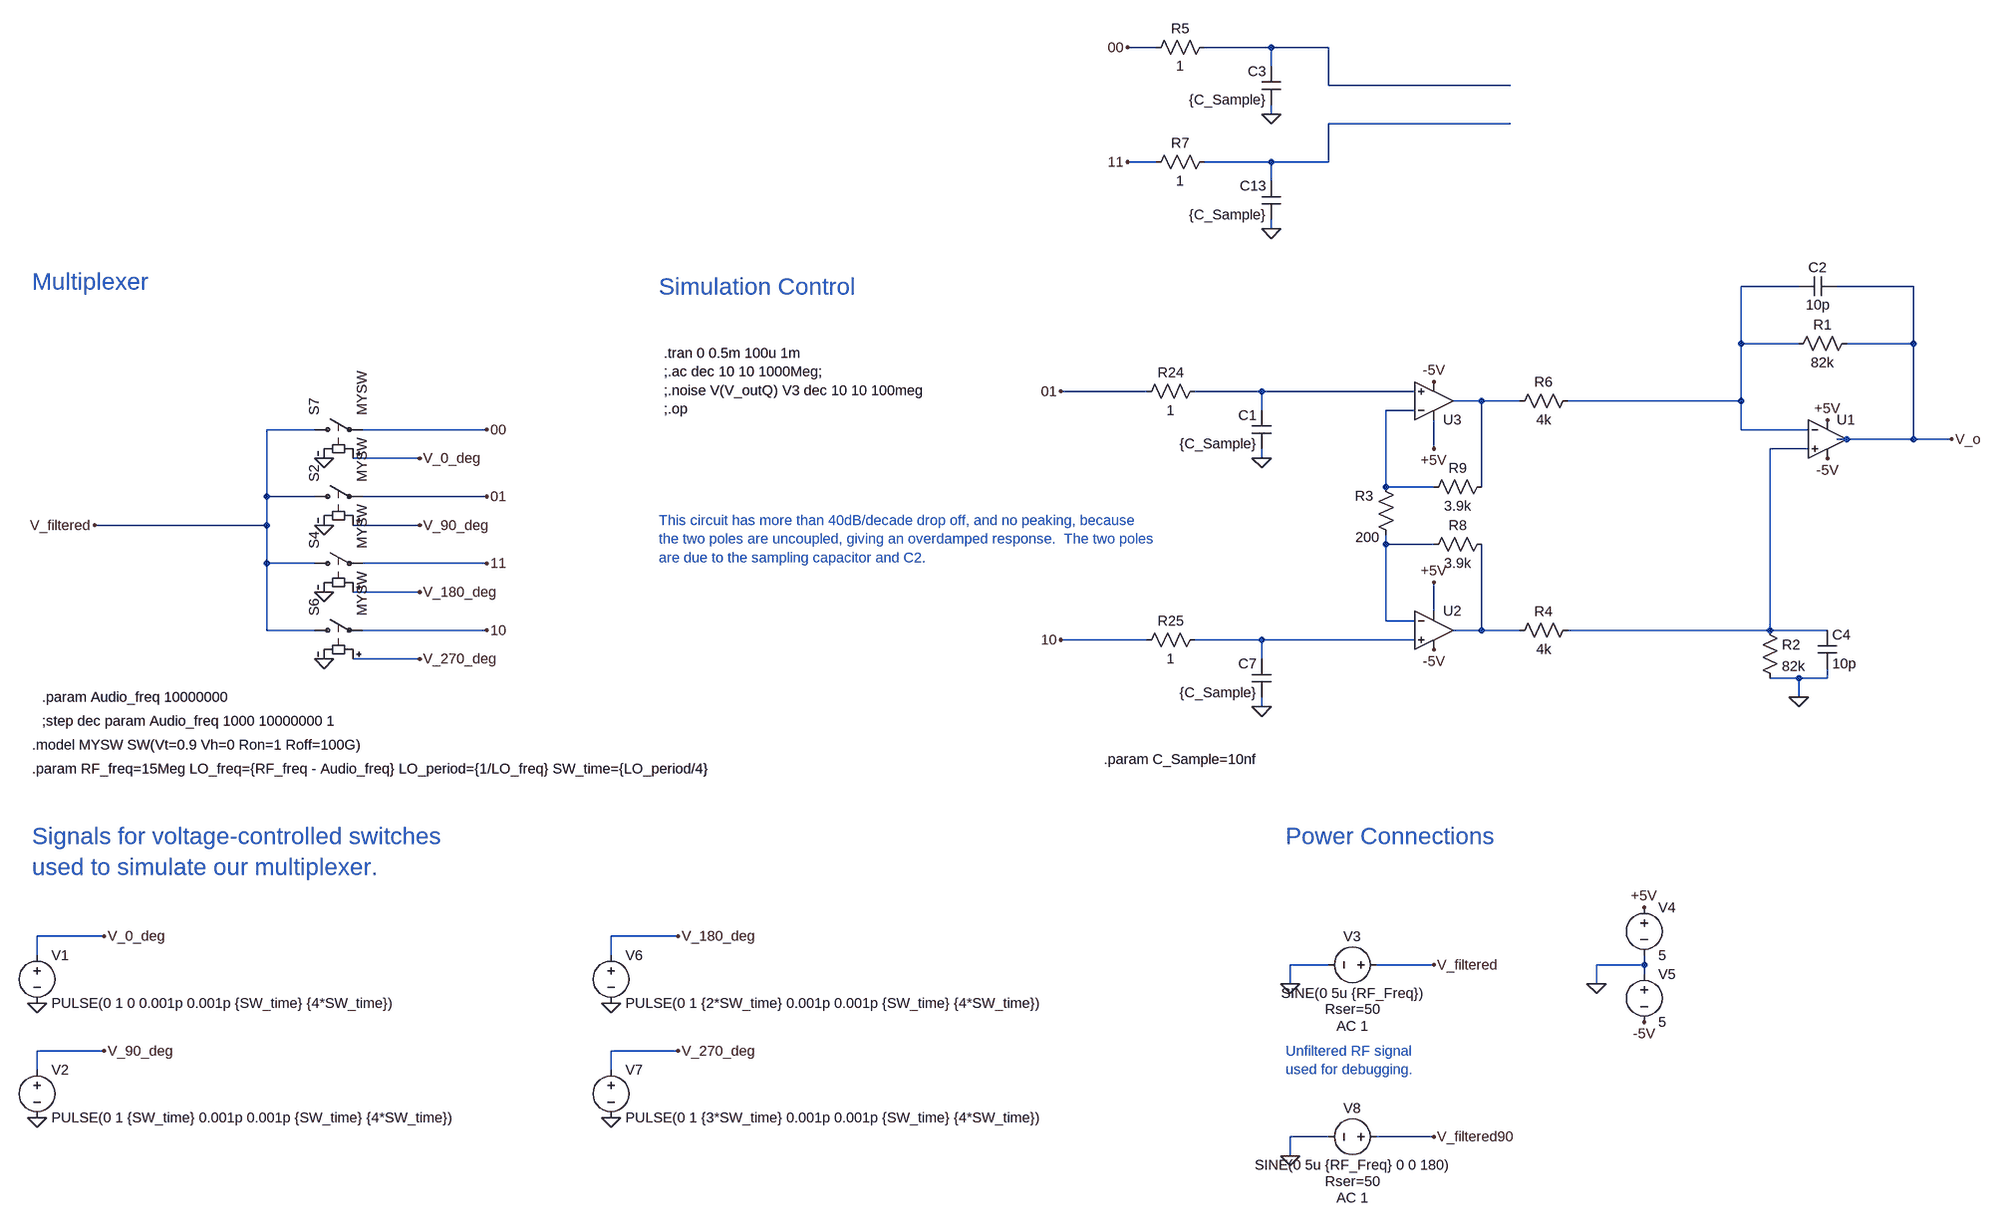
[diagram p0: schematic TayloeDetectorInstAmplifier.asc]
TayloeDetectorInstAmplifier.asc, the LTspice schematic file:
Version 4
SHEET 1 3200 1748
WIRE 1136 -688 1088 -688
WIRE 1328 -688 1216 -688
WIRE 1424 -688 1328 -688
WIRE 1328 -656 1328 -688
WIRE 1424 -624 1424 -688
WIRE 1728 -624 1424 -624
WIRE 1328 -576 1328 -592
WIRE 1728 -560 1424 -560
WIRE 1136 -496 1088 -496
WIRE 1328 -496 1216 -496
WIRE 1424 -496 1424 -560
WIRE 1424 -496 1328 -496
WIRE 1328 -464 1328 -496
WIRE 1328 -384 1328 -400
WIRE 2352 -288 2256 -288
WIRE 2544 -288 2416 -288
WIRE 2256 -192 2256 -288
WIRE 2352 -192 2256 -192
WIRE 2544 -192 2544 -288
WIRE 2544 -192 2432 -192
WIRE 1120 -112 976 -112
WIRE 1312 -112 1200 -112
WIRE 1568 -112 1312 -112
WIRE 1680 -96 1632 -96
WIRE 1744 -96 1680 -96
WIRE 2256 -96 2256 -192
WIRE 2256 -96 1824 -96
WIRE 1312 -80 1312 -112
WIRE 1568 -80 1520 -80
WIRE -272 -48 -352 -48
WIRE 16 -48 -192 -48
WIRE 2256 -48 2256 -96
WIRE 2368 -48 2256 -48
WIRE 2432 -32 2416 -32
WIRE 2544 -32 2544 -192
WIRE 2544 -32 2432 -32
WIRE 2608 -32 2544 -32
WIRE 1600 -16 1600 -64
WIRE 2368 -16 2304 -16
WIRE -96 0 -208 0
WIRE 1312 0 1312 -16
WIRE 1520 48 1520 -80
WIRE 1600 48 1520 48
WIRE 1680 48 1680 -96
WIRE -352 64 -352 -48
WIRE -272 64 -352 64
WIRE 16 64 -192 64
WIRE -352 112 -352 64
WIRE -352 112 -640 112
WIRE -96 112 -208 112
WIRE 1520 144 1520 128
WIRE 1600 144 1520 144
WIRE -352 176 -352 112
WIRE -272 176 -352 176
WIRE 16 176 -192 176
WIRE -96 224 -208 224
WIRE 1600 256 1600 208
WIRE 1520 272 1520 144
WIRE 1568 272 1520 272
WIRE -352 288 -352 176
WIRE -272 288 -352 288
WIRE 16 288 -192 288
WIRE 1680 288 1680 144
WIRE 1680 288 1632 288
WIRE 1744 288 1680 288
WIRE 2304 288 2304 -16
WIRE 2304 288 1824 288
WIRE 2400 288 2304 288
WIRE 1120 304 976 304
WIRE 1312 304 1200 304
WIRE 1568 304 1312 304
WIRE -96 336 -208 336
WIRE 1312 336 1312 304
WIRE 2352 368 2304 368
WIRE 2400 368 2400 352
WIRE 2400 368 2352 368
WIRE 2352 400 2352 368
WIRE 1312 416 1312 400
WIRE -624 800 -736 800
WIRE 336 800 224 800
WIRE -736 832 -736 800
WIRE 224 832 224 800
WIRE 1424 848 1360 848
WIRE 1600 848 1504 848
WIRE 1952 848 1952 832
WIRE 1952 848 1872 848
WIRE 1952 864 1952 848
WIRE 1360 880 1360 848
WIRE 1872 880 1872 848
WIRE -624 992 -736 992
WIRE 336 992 224 992
WIRE -736 1024 -736 992
WIRE 224 1024 224 992
WIRE 1424 1136 1360 1136
WIRE 1600 1136 1504 1136
WIRE 1360 1168 1360 1136
FLAG -256 0 0
FLAG -256 112 0
FLAG -256 224 0
FLAG -256 336 0
FLAG 1360 880 0
FLAG 1952 752 +5V
FLAG 1872 880 0
FLAG 1952 944 -5V
FLAG -96 0 V_0_deg
FLAG -96 112 V_90_deg
FLAG -96 224 V_180_deg
FLAG -96 336 V_270_deg
FLAG -736 912 0
FLAG -624 800 V_0_deg
FLAG -736 1104 0
FLAG -624 992 V_90_deg
FLAG 224 912 0
FLAG 336 800 V_180_deg
FLAG 224 1104 0
FLAG 336 992 V_270_deg
FLAG 16 -48 00
FLAG 16 176 11
FLAG 1600 848 V_filtered
FLAG -640 112 V_filtered
FLAG 1312 416 0
FLAG 1312 0 0
FLAG 16 64 01
FLAG 16 288 10
FLAG 1328 -384 0
FLAG 1328 -576 0
FLAG 1088 -496 11
FLAG 1088 -688 00
FLAG 1360 1168 0
FLAG 1600 1136 V_filtered90
FLAG 976 304 10
FLAG 976 -112 01
FLAG 2400 -64 +5V
FLAG 2400 0 -5V
FLAG 1600 -16 +5V
FLAG 1600 -128 -5V
FLAG 1600 320 -5V
FLAG 2352 400 0
FLAG 2608 -32 V_o
FLAG 1600 208 +5V
DATAFLAG 1408 304 ""
DATAFLAG 1392 -112 ""
SYMBOL sw -288 -48 R270
SYMATTR InstName S7
SYMATTR Value MYSW
SYMBOL sw -288 64 R270
SYMATTR InstName S2
SYMATTR Value MYSW
SYMBOL sw -288 176 R270
SYMATTR InstName S4
SYMATTR Value MYSW
SYMBOL sw -288 288 R270
SYMATTR InstName S6
SYMATTR Value MYSW
SYMBOL voltage 1520 848 R90
WINDOW 0 -32 56 VBottom 2
WINDOW 3 32 56 VTop 2
WINDOW 123 118 56 VBottom 2
WINDOW 39 90 56 VBottom 2
SYMATTR InstName V3
SYMATTR Value SINE(0 5u {RF_Freq})
SYMATTR Value2 AC 1
SYMATTR SpiceLine Rser=50
SYMBOL voltage 1952 736 R0
WINDOW 123 0 0 Left 0
WINDOW 39 0 0 Left 0
SYMATTR InstName V4
SYMATTR Value 5
SYMBOL voltage 1952 848 R0
WINDOW 123 0 0 Left 0
WINDOW 39 0 0 Left 0
SYMATTR InstName V5
SYMATTR Value 5
SYMBOL voltage -736 816 R0
WINDOW 123 0 0 Left 0
WINDOW 39 0 0 Left 0
SYMATTR InstName V1
SYMATTR Value PULSE(0 1 0 0.001p 0.001p {SW_time} {4*SW_time})
SYMBOL voltage -736 1008 R0
WINDOW 123 0 0 Left 0
WINDOW 39 0 0 Left 0
SYMATTR InstName V2
SYMATTR Value PULSE(0 1 {SW_time} 0.001p 0.001p {SW_time} {4*SW_time})
SYMBOL voltage 224 816 R0
WINDOW 123 0 0 Left 0
WINDOW 39 0 0 Left 0
SYMATTR InstName V6
SYMATTR Value PULSE(0 1 {2*SW_time} 0.001p 0.001p {SW_time} {4*SW_time})
SYMBOL voltage 224 1008 R0
WINDOW 123 0 0 Left 0
WINDOW 39 0 0 Left 0
SYMATTR InstName V7
SYMATTR Value PULSE(0 1 {3*SW_time} 0.001p 0.001p {SW_time} {4*SW_time})
SYMBOL cap 1328 -16 R180
WINDOW 0 24 56 Left 2
WINDOW 3 24 8 Left 2
SYMATTR InstName C1
SYMATTR Value {C_Sample}
SYMBOL cap 1328 400 R180
WINDOW 0 24 56 Left 2
WINDOW 3 24 8 Left 2
SYMATTR InstName C7
SYMATTR Value {C_Sample}
SYMBOL res 1216 -128 R90
WINDOW 0 0 56 VBottom 2
WINDOW 3 32 56 VTop 2
SYMATTR InstName R24
SYMATTR Value 1
SYMBOL res 1216 288 R90
WINDOW 0 0 56 VBottom 2
WINDOW 3 32 56 VTop 2
SYMATTR InstName R25
SYMATTR Value 1
SYMBOL cap 1344 -592 R180
WINDOW 0 24 56 Left 2
WINDOW 3 24 8 Left 2
SYMATTR InstName C3
SYMATTR Value {C_Sample}
SYMBOL cap 1344 -400 R180
WINDOW 0 24 56 Left 2
WINDOW 3 24 8 Left 2
SYMATTR InstName C13
SYMATTR Value {C_Sample}
SYMBOL res 1232 -704 R90
WINDOW 0 0 56 VBottom 2
WINDOW 3 32 56 VTop 2
SYMATTR InstName R5
SYMATTR Value 1
SYMBOL res 1232 -512 R90
WINDOW 0 0 56 VBottom 2
WINDOW 3 32 56 VTop 2
SYMATTR InstName R7
SYMATTR Value 1
SYMBOL voltage 1520 1136 R90
WINDOW 0 -32 56 VBottom 2
WINDOW 3 32 56 VTop 2
WINDOW 123 118 56 VBottom 2
WINDOW 39 90 56 VBottom 2
SYMATTR InstName V8
SYMATTR Value SINE(0 5u {RF_Freq} 0 0 180)
SYMATTR Value2 AC 1
SYMATTR SpiceLine Rser=50
SYMBOL res 2448 -208 R90
WINDOW 0 0 56 VBottom 2
WINDOW 3 32 56 VTop 2
SYMATTR InstName R1
SYMATTR Value 82k
SYMBOL Opamps\\UniversalOpamp2 2400 -32 R0
SYMATTR InstName U1
SYMATTR SpiceModel level.1
SYMATTR Value2 Avol=1Meg GBW=100Meg Slew=100Meg
SYMBOL cap 2416 -304 R90
WINDOW 0 0 32 VBottom 2
WINDOW 3 32 32 VTop 2
SYMATTR InstName C2
SYMATTR Value 10p
SYMBOL Opamps\\UniversalOpamp2 1600 288 R0
SYMATTR InstName U2
SYMATTR SpiceModel level.1
SYMATTR Value2 Avol=1Meg GBW=100Meg Slew=100Meg
SYMBOL Opamps\\UniversalOpamp2 1600 -96 M180
SYMATTR InstName U3
SYMATTR SpiceModel level.1
SYMATTR Value2 Avol=1Meg GBW=100Meg Slew=100Meg
SYMBOL res 1504 32 R0
WINDOW 0 -36 31 Left 2
WINDOW 3 -35 100 Left 2
SYMATTR InstName R3
SYMATTR Value 200
SYMBOL res 1840 272 R90
WINDOW 0 0 56 VBottom 2
WINDOW 3 32 56 VTop 2
SYMATTR InstName R4
SYMATTR Value 4k
SYMBOL res 1840 -112 R90
WINDOW 0 0 56 VBottom 2
WINDOW 3 32 56 VTop 2
SYMATTR InstName R6
SYMATTR Value 4k
SYMBOL res 2288 272 R0
SYMATTR InstName R2
SYMATTR Value 82k
SYMBOL cap 2384 288 R0
SYMATTR InstName C4
SYMATTR Value 10p
SYMBOL res 1696 128 R90
WINDOW 0 0 56 VBottom 2
WINDOW 3 32 56 VTop 2
SYMATTR InstName R8
SYMATTR Value 3.9k
SYMBOL res 1696 32 R90
WINDOW 0 0 56 VBottom 2
WINDOW 3 32 56 VTop 2
SYMATTR InstName R9
SYMATTR Value 3.9k
TEXT -744 480 Left 2 !.model MYSW SW(Vt=0.9 Vh=0 Ron=1 Roff=100G)
TEXT 312 -176 Left 2 !.tran 0 0.5m 100u 1m\n;.ac dec 10 10 1000Meg;\n;.noise V(V_outQ) V3 dec 10 10 100meg\n;.op
TEXT -744 520 Left 2 !.param RF_freq=15Meg LO_freq={RF_freq - Audio_freq} LO_period={1/LO_freq} SW_time={LO_period/4}
TEXT 1048 504 Left 2 !.param C_Sample=10nf
TEXT -744 632 Left 4 ;Signals for voltage-controlled switches \nused to simulate our multiplexer.
TEXT 1352 632 Left 4 ;Power Connections
TEXT 1352 992 Left 2 ;Unfiltered RF signal\nused for debugging.
TEXT -744 -296 Left 4 ;Multiplexer
TEXT 304 -288 Left 4 ;Simulation Control
TEXT -728 440 Left 2 !;step dec param Audio_freq 1000 10000000 1
TEXT -728 400 Left 2 !.param Audio_freq 10000000
TEXT 304 104 Left 2 ;This circuit has more than 40dB/decade drop off, and no peaking, because\nthe two poles are uncoupled, giving an overdamped response.  The two poles\nare due to the sampling capacitor and C2.

The netlist it stands for:
* TayloeDetectorInstAmplifier.asc
S7 V_filtered 00 V_0_deg 0 MYSW
S2 V_filtered 01 V_90_deg 0 MYSW
S4 V_filtered 11 V_180_deg 0 MYSW
S6 V_filtered 10 V_270_deg 0 MYSW
V3 V_filtered 0 SINE(0 5u {RF_Freq}) AC 1 Rser=50
V4 +5V 0 5
V5 0 -5V 5
V1 V_0_deg 0 PULSE(0 1 0 0.001p 0.001p {SW_time} {4*SW_time})
V2 V_90_deg 0 PULSE(0 1 {SW_time} 0.001p 0.001p {SW_time} {4*SW_time})
V6 V_180_deg 0 PULSE(0 1 {2*SW_time} 0.001p 0.001p {SW_time} {4*SW_time})
V7 V_270_deg 0 PULSE(0 1 {3*SW_time} 0.001p 0.001p {SW_time} {4*SW_time})
C1 0 N004 {C_Sample}
C7 0 N010 {C_Sample}
R24 N004 01 1
R25 N010 10 1
C3 0 N001 {C_Sample}
C13 0 N002 {C_Sample}
R5 N001 00 1
R7 N002 11 1
V8 V_filtered90 0 SINE(0 5u {RF_Freq} 0 0 180) AC 1 Rser=50
R1 V_o N003 82k
XU1 N007 N003 +5V -5V V_o level.1 Avol=1Meg GBW=100Meg Slew=100Meg ilimit=25m rail=0 Vos=0 phimargin=45 en=0 enk=0 in=0 ink=0 Rin=500Meg  ; pins IN+ IN- V+ V- OUT
C2 V_o N003 10p
XU2 N010 N008 +5V -5V N009 level.1 Avol=1Meg GBW=100Meg Slew=100Meg ilimit=25m rail=0 Vos=0 phimargin=45 en=0 enk=0 in=0 ink=0 Rin=500Meg  ; pins IN+ IN- V+ V- OUT
XU3 N004 N006 +5V -5V N005 level.1 Avol=1Meg GBW=100Meg Slew=100Meg ilimit=25m rail=0 Vos=0 phimargin=45 en=0 enk=0 in=0 ink=0 Rin=500Meg  ; pins IN+ IN- V+ V- OUT
R3 N006 N008 200
R4 N007 N009 4k
R6 N003 N005 4k
R2 N007 0 82k
C4 N007 0 10p
R8 N009 N008 3.9k
R9 N005 N006 3.9k
.model MYSW SW(Vt=0.9 Vh=0 Ron=1 Roff=100G)
.tran 0 0.5m 100u 1m
;.ac dec 10 10 1000Meg;
;.noise V(V_outQ) V3 dec 10 10 100meg
;.op
.param RF_freq=15Meg LO_freq={RF_freq - Audio_freq} LO_period={1/LO_freq} SW_time={LO_period/4}
.param C_Sample=10nf
* Signals for voltage-controlled switches
* used to simulate our multiplexer.
* Power Connections
* Unfiltered RF signal
* used for debugging.
* Multiplexer
* Simulation Control
;step dec param Audio_freq 1000 10000000 1
.param Audio_freq 10000000
* This circuit has more than 40dB/decade drop off, and no peaking, because
* the two poles are uncoupled, giving an overdamped response.  The two poles
* are due to the sampling capacitor and C2.
.lib UniversalOpamps2.sub
.backanno
.end